# EAGLE schematic nintendac (EAGLE 7.7.0)
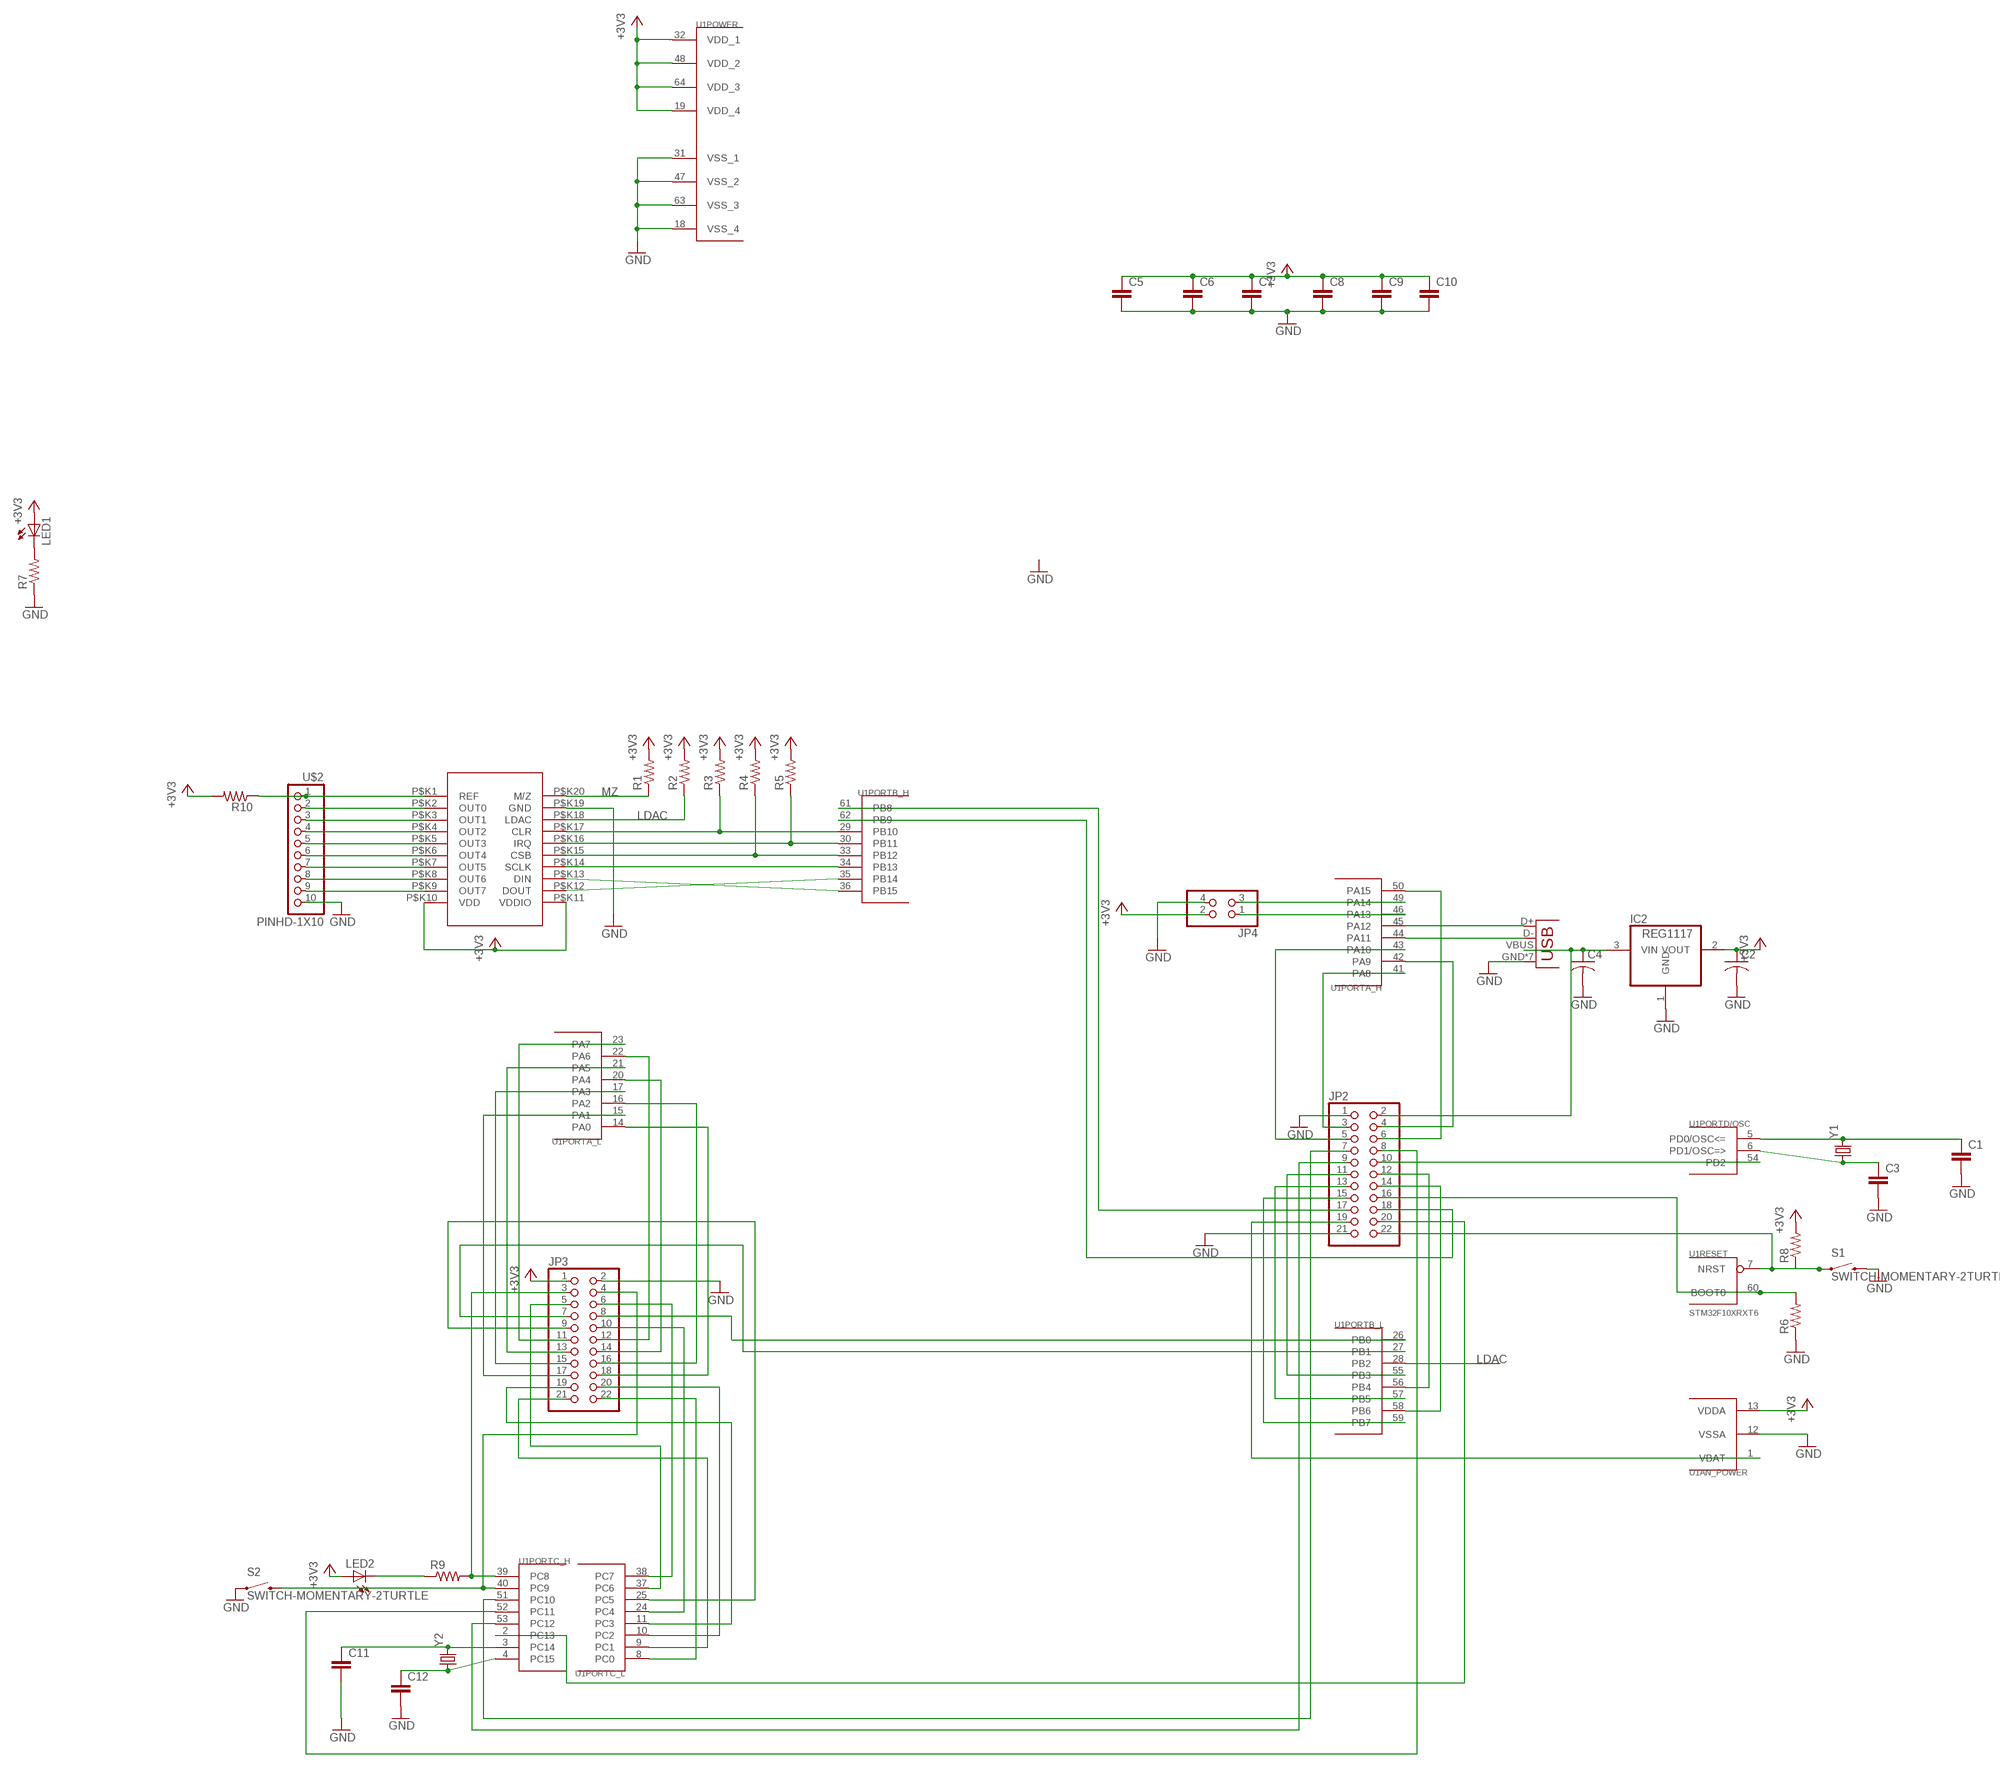
[diagram p0: schematic, sheet 1]

## Parts
C1  CAP0805  [0805]
C2  C-USC1210  [C1210]
C3  CAP0805  [0805]
C4  C-USC1210  [C1210]
C5  CAP0805  [0805]
C6  CAP0805  [0805]
C7  CAP0805  [0805]
C8  CAP0805  [0805]
C9  CAP0805  [0805]
C10  CAP0805  [0805]
C11  CAP0805  [0805]
C12  CAP0805  [0805]
IC2  REG1117  [SOT223]
JP2  PINHD-2X11  [2X11]
JP3  PINHD-2X11  [2X11]
JP4  PINHD-2X2  [2X02]
LED1  LEDCHIP-LED0805  [CHIP-LED0805]
LED2  LEDCHIP-LED0805  [CHIP-LED0805]
R1  RESISTOR0805-RES  [0805]
R2  RESISTOR0805-RES  [0805]
R3  RESISTOR0805-RES  [0805]
R4  RESISTOR0805-RES  [0805]
R5  RESISTOR0805-RES  [0805]
R6  RESISTOR0805-RES  [0805]
R7  RESISTOR0805-RES  [0805]
R8  RESISTOR0805-RES  [0805]
R9  RESISTOR0805-RES  [0805]
R10  RESISTOR0805-RES  [0805]
S1  SWITCH-MOMENTARY-2TURTLE  [KMR2]
S2  SWITCH-MOMENTARY-2TURTLE  [KMR2]
U1  STM32F10XRXT6  [TQFP64]
U$1  MAX572X  [TSSOP20]
U$2  PINHD-1X10  [1X10-BIG]
X1  USB-MICROB  [USB-MICROB]
Y1  CRYSTALHC49US  [HC49US]
Y2  CRYSTALTC26H_EZ  [TC26HEZ]

## Nets
+3V3: C2.1 C5.1 C6.1 C7.1 C8.1 C9.1 C10.1 IC2.2(VOUT) JP3.1 JP4.2 LED1.A LED2.A R1.2 R2.2 R3.2 R4.2 R5.2 R8.2 R10.2 U1.13(AN_POWER:VDDA) U1.19(POWER:VDD_4) U1.32(POWER:VDD_1) U1.48(POWER:VDD_2) U1.64(POWER:VDD_3) U$1.P$K10(VDD) U$1.P$K11(VDDIO)
GND: C1.2 C2.2 C3.2 C4.2 C5.2 C6.2 C7.2 C8.2 C9.2 C10.2 C11.2 C12.2 IC2.1(GND) JP2.1 JP2.21 JP3.2 JP4.4 R6.1 R7.1 S1.3 S2.1 U1.12(AN_POWER:VSSA) U1.18(POWER:VSS_4) U1.31(POWER:VSS_1) U1.47(POWER:VSS_2) U1.63(POWER:VSS_3) U$1.P$K19(GND) U$2.10 X1.GND X1.P1(GND) X1.P2(GND) X1.P3(GND) X1.P4(GND) X1.P5(GND) X1.P6(GND)
LDAC: R2.1 U1.28(PORTB_L:PB2) U$1.P$K18(LDAC)
MZ: R1.1 U$1.P$K20(M/Z)
N$1: JP2.22 R8.1 S1.1 U1.7(RESET:NRST)
N$3: U1.44(PORTA_H:PA11) X1.D-
N$4: U1.45(PORTA_H:PA12) X1.D+
N$5: C1.1 U1.5(PORTD/OSC:PD0/OSC<=) Y1.2
N$6: C3.1 U1.6(PORTD/OSC:PD1/OSC=>) Y1.1
N$7: R10.1 U$1.P$K1(REF) U$2.1
N$8: U$1.P$K2(OUT0) U$2.2
N$9: U$1.P$K3(OUT1) U$2.3
N$10: U$1.P$K4(OUT2) U$2.4
N$11: U$1.P$K5(OUT3) U$2.5
N$12: U$1.P$K6(OUT4) U$2.6
N$13: U$1.P$K7(OUT5) U$2.7
N$14: U$1.P$K8(OUT6) U$2.8
N$15: U$1.P$K9(OUT7) U$2.9
N$16: U1.36(PORTB_H:PB15) U$1.P$K13(DIN)
N$17: U1.35(PORTB_H:PB14) U$1.P$K12(DOUT)
N$18: U1.34(PORTB_H:PB13) U$1.P$K14(SCLK)
N$19: R4.1 U1.33(PORTB_H:PB12) U$1.P$K15(CSB)
N$20: R5.1 U1.30(PORTB_H:PB11) U$1.P$K16(IRQ)
N$21: R3.1 U1.29(PORTB_H:PB10) U$1.P$K17(CLR)
N$22: JP4.3 U1.49(PORTA_H:PA14)
N$23: JP3.5 U1.37(PORTC_L:PC6)
N$24: JP4.1 U1.46(PORTA_H:PA13)
N$25: JP3.6 U1.38(PORTC_L:PC7)
N$26: JP2.16 R6.2 U1.60(RESET:BOOT0)
N$27: LED1.C R7.2
N$28: C11.1 U1.3(PORTC_H:PC14) Y2.2
N$29: C12.1 U1.4(PORTC_H:PC15) Y2.1
N$30: JP3.4 S2.3 U1.40(PORTC_H:PC9)
N$31: JP2.3 U1.41(PORTA_H:PA8)
N$32: JP3.3 R9.2 U1.39(PORTC_H:PC8)
N$33: JP2.4 U1.42(PORTA_H:PA9)
N$34: JP2.5 U1.43(PORTA_H:PA10)
N$35: JP3.7 U1.27(PORTB_L:PB1)
N$36: JP3.8 U1.26(PORTB_L:PB0)
N$37: JP3.9 U1.25(PORTC_L:PC5)
N$38: JP3.10 U1.24(PORTC_L:PC4)
N$39: JP3.11 U1.23(PORTA_L:PA7)
N$40: JP3.12 U1.22(PORTA_L:PA6)
N$41: JP3.13 U1.21(PORTA_L:PA5)
N$42: JP3.14 U1.20(PORTA_L:PA4)
N$43: JP3.15 U1.17(PORTA_L:PA3)
N$44: JP3.16 U1.16(PORTA_L:PA2)
N$45: JP3.17 U1.15(PORTA_L:PA1)
N$46: JP3.18 U1.14(PORTA_L:PA0)
N$47: JP3.22 U1.8(PORTC_L:PC0)
N$48: JP3.21 U1.9(PORTC_L:PC1)
N$49: JP3.20 U1.10(PORTC_L:PC2)
N$50: JP3.19 U1.11(PORTC_L:PC3)
N$51: JP2.6 U1.50(PORTA_H:PA15)
N$52: JP2.7 U1.51(PORTC_H:PC10)
N$53: JP2.9 U1.53(PORTC_H:PC12)
N$54: JP2.8 U1.52(PORTC_H:PC11)
N$55: JP2.10 U1.54(PORTD/OSC:PD2)
N$56: JP2.11 U1.55(PORTB_L:PB3)
N$57: JP2.12 U1.56(PORTB_L:PB4)
N$58: JP2.13 U1.57(PORTB_L:PB5)
N$59: JP2.14 U1.58(PORTB_L:PB6)
N$60: JP2.15 U1.59(PORTB_L:PB7)
N$61: JP2.17 U1.61(PORTB_H:PB8)
N$62: JP2.18 U1.62(PORTB_H:PB9)
N$63: JP2.19 U1.1(AN_POWER:VBAT)
N$64: JP2.20 U1.2(PORTC_H:PC13)
N$65: LED2.C R9.1
N$66: C4.1 IC2.3(VIN) JP2.2 X1.VBUS

## Library data of the parts
C1 C3 C5-C12 = backplane:CAP: Capacitor Standard 0603 ceramic capacitor, and 0.1" leaded capacitor.
C2 C4 = backplane:C-US: CAPACITOR, American symbol
IC2 = backplane:REG1117: 800mA and 1A Low Dropout (LDO) Positive Regulator 1.8V, 2.5V, 2.85V, 3.3V, 5V, and Adj; MPN: REG1117; OC_FARNELL: 1097566; OC_NEWARK: 14P6981
JP2 JP3 = pinhead:PINHD-2X11: PIN HEADER
JP4 = pinhead:PINHD-2X2: PIN HEADER
LED1 LED2 = backplane:LED: LED OSRAM: - CHIPLED LG R971, LG N971, LY N971, LG Q971, LY Q971, LO R971, LY R971 LH N974, LH R974 LS Q976, LO Q976, LY Q976 LO Q996 - Hyper CHIPLED LW Q18S LB Q993, LB Q99A, LB R99A - SideLED LS A670, LO A670, LY A670, LG A670, LP A670 LB A673, LV A673, LT A673, LW A673 LH A674 LY A675 LS A676, LA A676, LO A676, LY A676, LW A676 LS A679, LY A679, LG A679 - Hyper Micro SIDELED® LS Y876, LA Y876, LO Y876, LY Y876 LT Y87S - SmartLED LW L88C, LW L88S LB L89C, LB L89S, LG L890 LS L89K, LO L89K, LY L89K LS L896, LA L896, LO L896, LY L896 - TOPLED LS T670, LO T670, LY T670, LG T670, LP T670 LSG T670, LSP T670, LSY T670, LOP T670, LYG T670 LG T671, LOG T671, LSG T671 LB T673, LV T673, LT T673, LW T673 LH T674 LS T676, LA T676, LO T676, LY T676, LB T676, LH T676, LSB T676, LW T676 LB T67C, LV T67C, LT T67C, LS T67K, LO T67K, LY T67K, LW E67C LS E67B, LA E67B, LO E67B, LY E67B, LB E67C, LV E67C, LT E67C LW T67C LS T679, LY T679, LG T679 LS T770, LO T770, LY T770, LG T770, LP T770 LB T773, LV T773, LT T773, LW T773 LH T774 LS E675, LA E675, LY E675, LS T675 LS T776, LA T776, LO T776, LY T776, LB T776 LHGB T686 LT T68C, LB T68C - Hyper Mini TOPLED® LB M676 - Mini TOPLED Santana® LG M470 LS M47K, LO M47K, LY M47K Source: http://www.osram.convergy.de/
R1-R10 = SparkFun-Passives:RESISTOR: Resistor Basic schematic elements and footprints for 0603, 1206, and PTH resistors.
S1 S2 = Adafruit Feather M0 Adalogger:SWITCH-MOMENTARY-2: Various NO switches- pushbuttons, reed, etc
U1 = backplane:STM32F10XRXT6: STM32F101/103 64pin LQFP
U$1 = kevin:MAX572X
U$2 = adafruit:PINHD-1X10: Pin header 1x10 0.1" spacing With round pins
X1 = backplane:USB: USB Connectors USB-B-PTH is fully proven SKU : PRT-00139/CONN-08278 USB-miniB is fully proven SKU : PRT-00587 USB-A-PCB is untested. USB-A-H is throughly reviewed, but untested. Spark Fun Electronics SKU : PRT-00437 USB-B-SMT is throughly reviewed, but untested. Needs silkscreen touching up. USB-A-S has not been used/tested USB-MB-H has not been used/tested USB-MICROB has been used. CONN-09505; PROD_ID: CONN-09505
Y1 Y2 = backplane:CRYSTAL: Various standard crystals. Proven footprints.